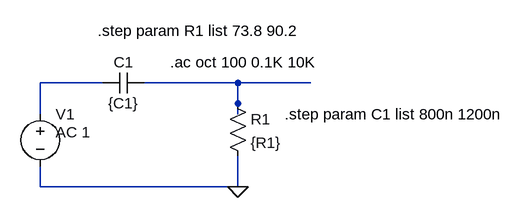
[diagram p0: schematic Livrable N°1_Passe_haut.asc]
Livrable N°1_Passe_haut.asc, the LTspice schematic file:
Version 4
SHEET 1 880 680
WIRE 112 96 16 96
WIRE 320 96 176 96
WIRE 432 96 320 96
WIRE 320 128 320 96
WIRE 16 144 16 96
WIRE 320 144 320 128
WIRE 16 256 16 224
WIRE 320 256 320 208
WIRE 320 256 16 256
FLAG 320 256 0
SYMBOL voltage 16 128 R0
WINDOW 123 24 44 Left 2
WINDOW 39 0 0 Left 0
SYMATTR Value2 AC 1
SYMATTR InstName V1
SYMATTR Value ""
SYMBOL res 304 112 R0
SYMATTR InstName R1
SYMATTR Value {R1}
SYMBOL cap 176 80 R90
WINDOW 0 0 32 VBottom 2
WINDOW 3 32 32 VTop 2
SYMATTR InstName C1
SYMATTR Value {C1}
TEXT 216 64 Left 2 !.ac oct 100 0.1K 10K
TEXT 104 16 Left 2 !.step param R1 list 73.8 90.2
TEXT 392 144 Left 2 !.step param C1 list 800n 1200n

The netlist it stands for:
* Livrable N°1_Passe_haut.asc
V1 N001 0 AC 1
R1 N002 0 {R1}
C1 N002 N001 {C1}
.ac oct 100 0.1K 10K
.step param R1 list 73.8 90.2
.step param C1 list 800n 1200n
.backanno
.end